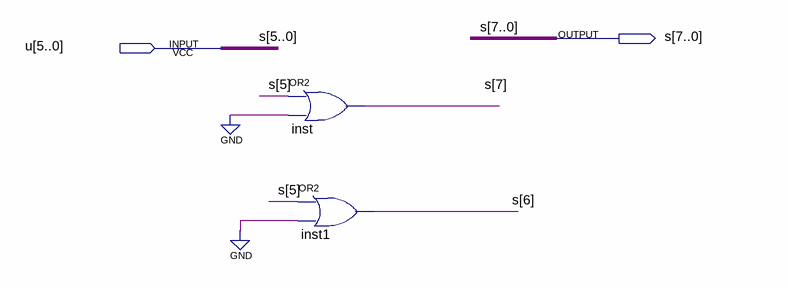
[diagram p0: schematic sheet]
// Quartus schematic SignExtend.bdf as structural Verilog: 2 symbols, 2 pins
module SignExtend (
  input  [5:0] u,
  output [7:0] s
);

  or inst (s[7], u[5], 1'b0);
  or inst1 (s[6], u[5], 1'b0);

  assign s[5:0] = u;
endmodule
